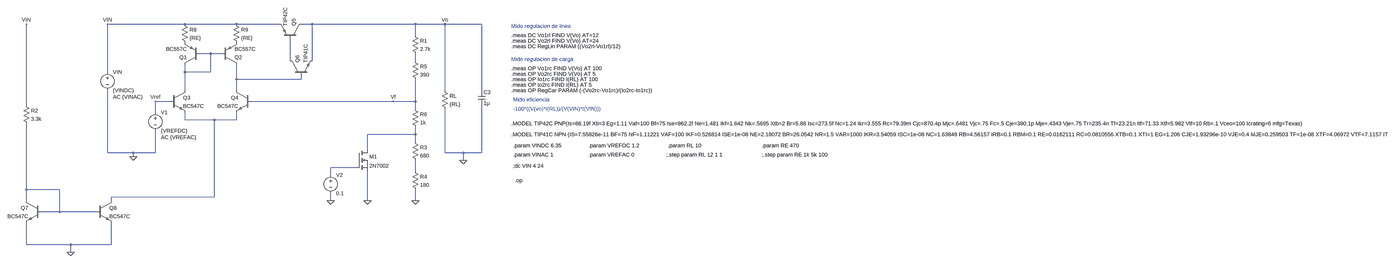
[diagram p0: schematic Regulador_Lineal_version4.asc, whole sheet]
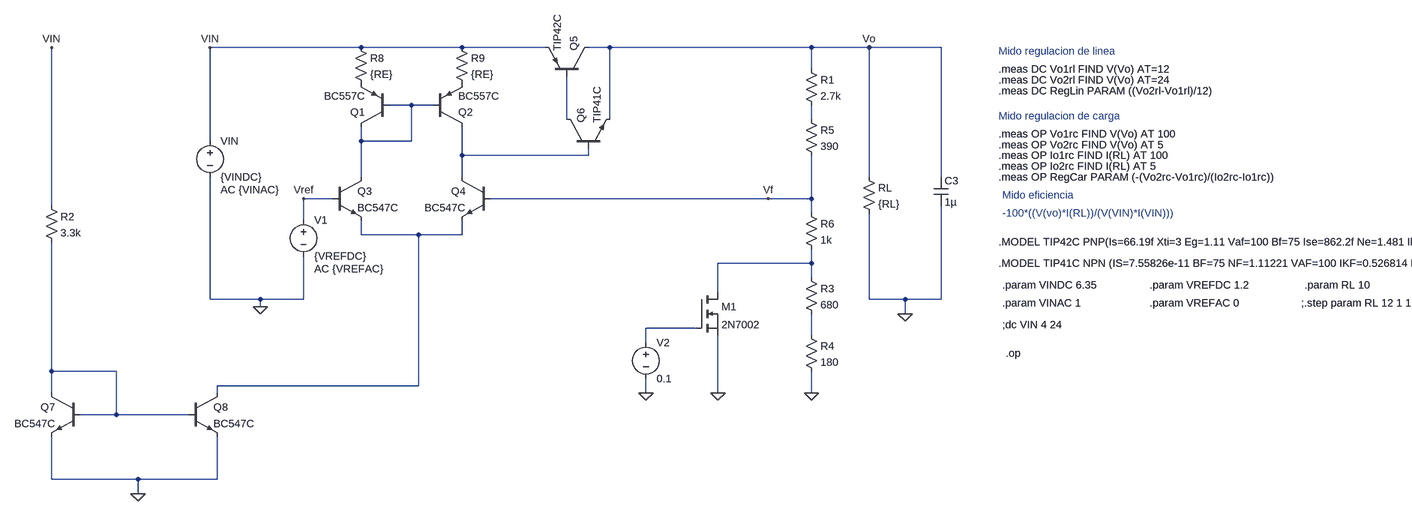
[diagram p1: schematic Regulador_Lineal_version4.asc, part, row 1 of 1, column 1 of 2]
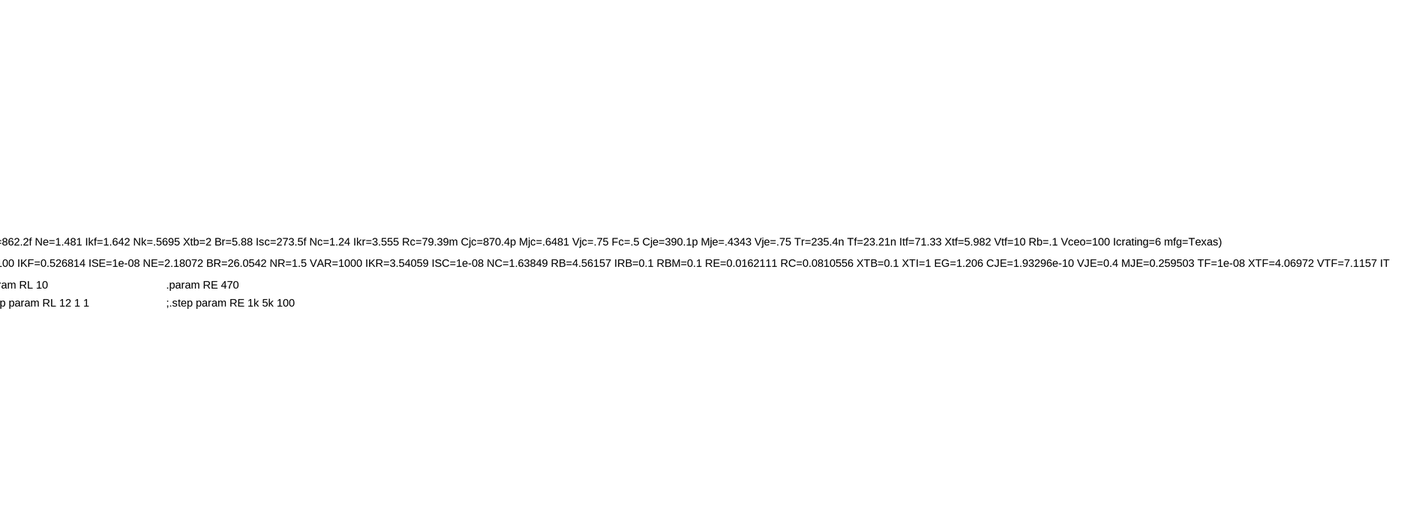
[diagram p2: schematic Regulador_Lineal_version4.asc, part, row 1 of 1, column 2 of 2]
Regulador_Lineal_version4.asc, the LTspice schematic file:
Version 4
SHEET 1 7440 1108
WIRE 96 -32 -240 -32
WIRE 320 -32 96 -32
WIRE 640 -32 320 -32
WIRE 784 -32 736 -32
WIRE 1232 -32 784 -32
WIRE 1360 -32 1232 -32
WIRE 1520 -32 1360 -32
WIRE 1232 16 1232 -32
WIRE 208 96 160 96
WIRE 256 96 208 96
WIRE 688 128 688 32
WIRE 784 128 784 -32
WIRE 1232 128 1232 96
WIRE -240 176 -240 -32
WIRE 96 176 96 144
WIRE 208 176 208 96
WIRE 208 176 96 176
WIRE 320 208 320 144
WIRE 736 208 736 192
WIRE 736 208 320 208
WIRE 96 256 96 176
WIRE 320 256 320 208
WIRE 1360 256 1360 -32
WIRE 1520 256 1520 -32
WIRE 32 304 -32 304
WIRE 1136 304 384 304
WIRE 1232 304 1232 208
WIRE 1232 304 1136 304
WIRE -592 320 -592 -32
WIRE 1232 336 1232 304
WIRE -32 352 -32 304
WIRE 96 384 96 352
WIRE 224 384 96 384
WIRE 320 384 320 352
WIRE 320 384 224 384
WIRE 1232 448 1232 416
WIRE 1232 448 1024 448
WIRE 1232 480 1232 448
WIRE 1024 512 1024 448
WIRE -240 528 -240 256
WIRE -128 528 -240 528
WIRE -32 528 -32 432
WIRE -32 528 -128 528
WIRE 1360 528 1360 336
WIRE 1440 528 1360 528
WIRE 1520 528 1520 320
WIRE 1520 528 1440 528
WIRE -128 544 -128 528
WIRE 1440 560 1440 528
WIRE 976 592 864 592
WIRE 1232 608 1232 560
WIRE 864 624 864 592
WIRE -592 688 -592 400
WIRE -448 688 -592 688
WIRE 224 720 224 384
WIRE 224 720 -224 720
WIRE -592 736 -592 688
WIRE -224 736 -224 720
WIRE 864 736 864 704
WIRE 1024 736 1024 608
WIRE 1232 736 1232 688
WIRE -448 784 -448 688
WIRE -448 784 -528 784
WIRE -288 784 -448 784
WIRE -592 928 -592 832
WIRE -400 928 -592 928
WIRE -224 928 -224 832
WIRE -224 928 -400 928
WIRE -400 960 -400 928
FLAG 1360 -32 Vo
FLAG -32 304 Vref
FLAG -240 -32 VIN
FLAG 1136 304 Vf
FLAG -128 544 0
FLAG -400 960 0
FLAG -592 -32 VIN
FLAG 1440 560 0
FLAG 1232 736 0
FLAG 1024 736 0
FLAG 864 736 0
DATAFLAG 1200 -32 ""
DATAFLAG 624 304 ""
DATAFLAG 1024 448 ""
SYMBOL pnp 160 144 R180
SYMATTR InstName Q1
SYMATTR Value BC557C
SYMBOL pnp 256 144 M180
SYMATTR InstName Q2
SYMATTR Value BC557C
SYMBOL npn 32 256 R0
SYMATTR InstName Q3
SYMATTR Value BC547C
SYMBOL npn 384 256 M0
SYMATTR InstName Q4
SYMATTR Value BC547C
SYMBOL pnp 736 32 M270
SYMATTR InstName Q5
SYMATTR Value TIP42C
SYMBOL npn 688 192 R270
SYMATTR InstName Q6
SYMATTR Value TIP41C
SYMBOL res 1216 112 R0
SYMATTR InstName R5
SYMATTR Value 390
SYMBOL res 1216 320 R0
SYMATTR InstName R6
SYMATTR Value 1k
SYMBOL res 1344 240 R0
SYMATTR InstName RL
SYMATTR Value {RL}
SYMBOL voltage -32 336 R0
WINDOW 123 24 124 Left 2
WINDOW 39 0 0 Left 0
SYMATTR Value2 AC {VREFAC}
SYMATTR InstName V1
SYMATTR Value {VREFDC}
SYMBOL voltage -240 160 R0
WINDOW 123 24 124 Left 2
WINDOW 39 0 0 Left 0
SYMATTR Value2 AC {VINAC}
SYMATTR InstName VIN
SYMATTR Value {VINDC}
SYMBOL res 80 -48 R0
SYMATTR InstName R8
SYMATTR Value {RE}
SYMBOL res 304 -48 R0
SYMATTR InstName R9
SYMATTR Value {RE}
SYMBOL cap 1504 256 R0
SYMATTR InstName C3
SYMATTR Value 1µ
SYMBOL npn -528 736 M0
SYMATTR InstName Q7
SYMATTR Value BC547C
SYMBOL npn -288 736 R0
SYMATTR InstName Q8
SYMATTR Value BC547C
SYMBOL res -608 304 R0
SYMATTR InstName R2
SYMATTR Value 3.3k
SYMBOL res 1216 0 R0
SYMATTR InstName R1
SYMATTR Value 2.7k
SYMBOL res 1216 464 R0
SYMATTR InstName R3
SYMATTR Value 680
SYMBOL res 1216 592 R0
SYMATTR InstName R4
SYMATTR Value 180
SYMBOL nmos 976 512 R0
SYMATTR InstName M1
SYMATTR Value 2N7002
SYMBOL voltage 864 608 R0
WINDOW 123 0 0 Left 0
WINDOW 39 0 0 Left 0
SYMATTR InstName V2
SYMATTR Value 0.1
TEXT 1664 648 Left 2 !.op
TEXT 1656 496 Left 2 !.param VINDC 6.35
TEXT 1656 536 Left 2 !.param VINAC 1
TEXT 1984 496 Left 2 !.param VREFDC 1.2
TEXT 1984 536 Left 2 !.param VREFAC 0
TEXT 2328 496 Left 2 !.param RL 10
TEXT 1656 584 Left 2 !;dc VIN 4 24
TEXT 2736 536 Left 2 !;.step param RE 1k 5k 100
TEXT 2736 496 Left 2 !.param RE 470
TEXT 2320 536 Left 2 !;.step param RL 12 1 1
TEXT 1648 -24 Left 2 ;Mido regulacion de linea
TEXT 1648 16 Left 2 !.meas DC Vo1rl FIND V(Vo) AT=12
TEXT 1648 40 Left 2 !.meas DC Vo2rl FIND V(Vo) AT=24
TEXT 1648 64 Left 2 !.meas DC RegLin PARAM ((Vo2rl-Vo1rl)/12)
TEXT 1648 120 Left 2 ;Mido regulacion de carga
TEXT 1648 160 Left 2 !.meas OP Vo1rc FIND V(Vo) AT 100
TEXT 1648 184 Left 2 !.meas OP Vo2rc FIND V(Vo) AT 5
TEXT 1648 208 Left 2 !.meas OP Io1rc FIND I(RL) AT 100
TEXT 1648 232 Left 2 !.meas OP Io2rc FIND I(RL) AT 5
TEXT 1656 296 Left 2 ;Mido eficiencia
TEXT 1656 336 Left 2 ;-100*((V(vo)*I(RL))/(V(VIN)*I(VIN)))
TEXT 1648 256 Left 2 !.meas OP RegCar PARAM (-(Vo2rc-Vo1rc)/(Io2rc-Io1rc))
TEXT 1648 400 Left 2 !.MODEL TIP42C PNP(Is=66.19f Xti=3 Eg=1.11 Vaf=100 Bf=75 Ise=862.2f Ne=1.481 Ikf=1.642 Nk=.5695 Xtb=2 Br=5.88 Isc=273.5f Nc=1.24 Ikr=3.555 Rc=79.39m Cjc=870.4p Mjc=.6481 Vjc=.75 Fc=.5 Cje=390.1p Mje=.4343 Vje=.75 Tr=235.4n Tf=23.21n Itf=71.33 Xtf=5.982 Vtf=10 Rb=.1 Vceo=100 Icrating=6 mfg=Texas)
TEXT 1648 448 Left 2 !.MODEL TIP41C NPN (IS=7.55826e-11 BF=75 NF=1.11221 VAF=100 IKF=0.526814 ISE=1e-08 NE=2.18072 BR=26.0542 NR=1.5 VAR=1000 IKR=3.54059 ISC=1e-08 NC=1.63849 RB=4.56157 IRB=0.1 RBM=0.1 RE=0.0162111 RC=0.0810556 XTB=0.1 XTI=1 EG=1.206 CJE=1.93296e-10 VJE=0.4 MJE=0.259503 TF=1e-08 XTF=4.06972 VTF=7.1157 ITF=0.001 CJC=1.09657e-10 VJC=0.730921 MJC=0.23 XCJC=0.803085 FC=0.8 TR=9.01013e-08 PTF=0 Vceo=100 ICrating=6 mfg=ON_Semi)

The netlist it stands for:
* Regulador_Lineal_version4.asc
Q1 N001 N001 P001 0 BC557C
Q2 N004 N001 P002 0 BC557C
Q3 N001 Vref N005 0 BC547C
Q4 N004 Vf N005 0 BC547C
Q5 Vo N002 VIN 0 TIP42C
Q6 N002 N004 Vo 0 TIP41C
R5 N003 Vf 390
R6 Vf N006 1k
RL Vo 0 {RL}
V1 Vref 0 {VREFDC} AC {VREFAC}
VIN VIN 0 {VINDC} AC {VINAC}
R8 VIN P001 {RE}
R9 VIN P002 {RE}
C3 Vo 0 1µ
Q7 N009 N009 0 0 BC547C
Q8 N005 N009 0 0 BC547C
R2 VIN N009 3.3k
R1 Vo N003 2.7k
R3 N006 N008 680
R4 N008 0 180
M1 N006 N007 0 0 2N7002
V2 N007 0 0.1
.model NPN NPN
.model PNP PNP
.lib standard.bjt
.model NMOS NMOS
.model PMOS PMOS
.lib standard.mos
.op
.param VINDC 6.35
.param VINAC 1
.param VREFDC 1.2
.param VREFAC 0
.param RL 10
;dc VIN 4 24
;.step param RE 1k 5k 100
.param RE 470
;.step param RL 12 1 1
* Mido regulacion de linea
.meas DC Vo1rl FIND V(Vo) AT=12
.meas DC Vo2rl FIND V(Vo) AT=24
.meas DC RegLin PARAM ((Vo2rl-Vo1rl)/12)
* Mido regulacion de carga
.meas OP Vo1rc FIND V(Vo) AT 100
.meas OP Vo2rc FIND V(Vo) AT 5
.meas OP Io1rc FIND I(RL) AT 100
.meas OP Io2rc FIND I(RL) AT 5
* Mido eficiencia
* -100*((V(vo)*I(RL))/(V(VIN)*I(VIN)))
.meas OP RegCar PARAM (-(Vo2rc-Vo1rc)/(Io2rc-Io1rc))
.MODEL TIP42C PNP(Is=66.19f Xti=3 Eg=1.11 Vaf=100 Bf=75 Ise=862.2f Ne=1.481 Ikf=1.642 Nk=.5695 Xtb=2 Br=5.88 Isc=273.5f Nc=1.24 Ikr=3.555 Rc=79.39m Cjc=870.4p Mjc=.6481 Vjc=.75 Fc=.5 Cje=390.1p Mje=.4343 Vje=.75 Tr=235.4n Tf=23.21n Itf=71.33 Xtf=5.982 Vtf=10 Rb=.1 Vceo=100 Icrating=6 mfg=Texas)
.MODEL TIP41C NPN (IS=7.55826e-11 BF=75 NF=1.11221 VAF=100 IKF=0.526814 ISE=1e-08 NE=2.18072 BR=26.0542 NR=1.5 VAR=1000 IKR=3.54059 ISC=1e-08 NC=1.63849 RB=4.56157 IRB=0.1 RBM=0.1 RE=0.0162111 RC=0.0810556 XTB=0.1 XTI=1 EG=1.206 CJE=1.93296e-10 VJE=0.4 MJE=0.259503 TF=1e-08 XTF=4.06972 VTF=7.1157 ITF=0.001 CJC=1.09657e-10 VJC=0.730921 MJC=0.23 XCJC=0.803085 FC=0.8 TR=9.01013e-08 PTF=0 Vceo=100 ICrating=6 mfg=ON_Semi)
.backanno
.end